# Altium schematic sheet GPS_and_Telemetry.SchDoc
size A4; SheetNumber: 4; SheetTotal: 6
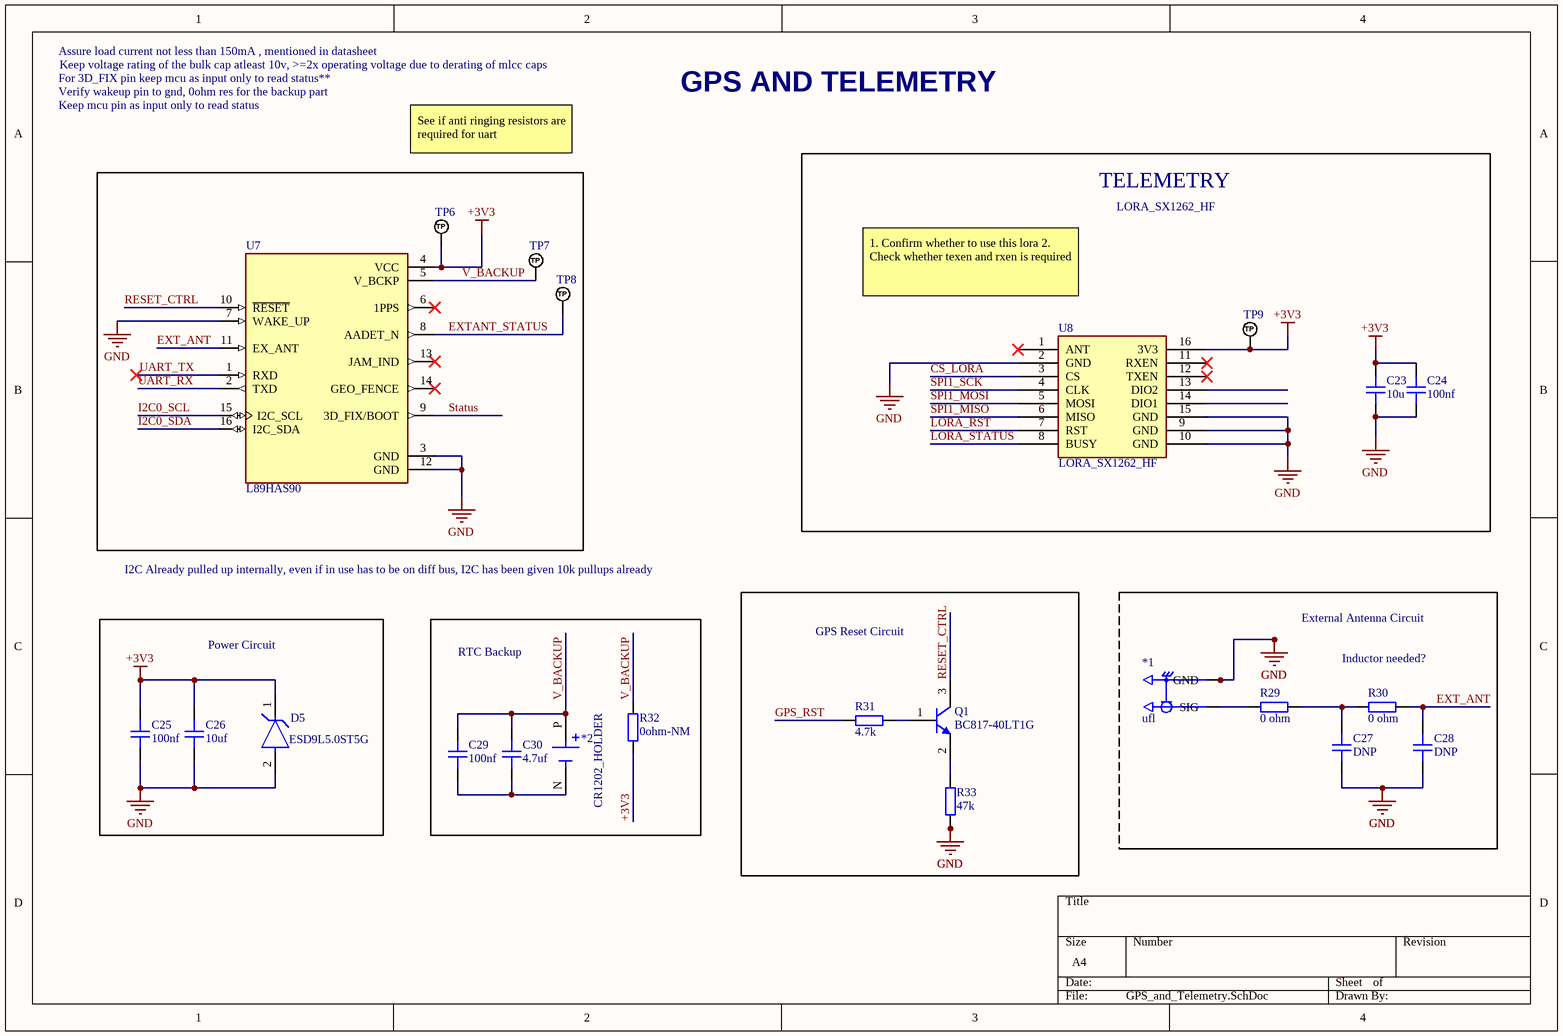
[diagram p0: GPS_and_Telemetry.SchDoc]

## Parts
*1  ufl  [UFL]
*2  CR1202_HOLDER  [CR1220_CELL_HOLDER]
C23  10u  [CAP_0805]
C24  100nf  [CAP_0402]
C25  100nf  [CAP_0402]
C26  10uf  [CAP_0805]
C27  DNP  [CAP_0402]
C28  DNP  [CAP_0402]
C29  100nf  [CAP_0402]
C30  4.7uf  [CAP_0805]
D5  ESD9L5.0ST5G  [On_Semiconductor_514AB_MFG]
Q1  BC817-40LT1G  [ONSC-SOT-23-3-318-08_V]
R29  0 ohm  [RES_0402]
R30  0 ohm  [RES_0402]
R31  4.7k  [RES_0402]
R32  0ohm-NM  [RES_0603]
R33  47k  [RES_0402]
TP6  TEST_POINT_RND_1MM  [PAD_RND_1MM]  (value not drawn)  (no BOM)
TP7  TEST_POINT_RND_1MM  [PAD_RND_1MM]  (value not drawn)  (no BOM)
TP8  TEST_POINT_RND_1MM  [PAD_RND_1MM]  (value not drawn)  (no BOM)
TP9  TEST_POINT_RND_1MM  [PAD_RND_1MM]  (value not drawn)  (no BOM)
U7  L89HAS90  [XCVR_L89HAS90]
U8  LORA_SX1262_HF  [LORA_SX1262_HF]

## Blocks framed on the sheet
TELEMETRY: C23 C24 TP9 U8
Power Circuit: C25 C26 D5
RTC Backup: *2 C29 C30 R32
GPS Reset Circuit: Q1 R31 R33

## Nets
+3V3: C23.2 C24.2 C25.2 C26.2 D5.1(C) R32.1 TP6.1(TP) TP9.1(TP) U7.4(VCC) U8.16(3V3)
GND: *1.1(GND) *1.2(GND) C23.1 C24.1 C25.1 C26.1 C27.1 C28.1 D5.2(A) R33.1 U7.3(GND) U7.7(WAKE_UP) U7.12(GND) U8.2(GND) U8.9(GND) U8.10(GND) U8.15(GND)
CS_LORA: U8.3(CS)
EXT_ANT: C28.2 R30.2 U7.11(EX_ANT)
EXTANT_STATUS: TP8.1(TP) U7.8(AADET_N)
GPS_RST: R31.1
I2C0_SCL: U7.15(I2C_SCL)
I2C0_SDA: U7.16(I2C_SDA)
LORA_RST: U8.7(RST)
LORA_STATUS: U8.8(BUSY)
RESET_CTRL: Q1.3(C) U7.10(~{RESET})
SPI1_MISO: U8.6(MISO)
SPI1_MOSI: U8.5(MOSI)
SPI1_SCK: U8.4(CLK)
Status: U7.9(3D_FIX/BOOT)
UART_RX: U7.2(TXD)
UART_TX: U7.1(RXD)
V_BACKUP: *2.P(POS) C29.2 C30.2 R32.2 TP7.1(TP) U7.5(V_BCKP)
Net*1_3: *1.3(SIG) R29.1
Net*2_N: *2.N(NEG) C29.1 C30.1
NetC27_2: C27.2 R29.2 R30.1
NetQ1_1: Q1.1(B) R31.2
NetQ1_2: Q1.2(E) R33.2

Not connected (* = marked no-connect by the designer): U7 6(1PPS)* 13(JAM_IND)* 14(GEO_FENCE)*; U8 1(ANT)* 11(RXEN)* 12(TXEN)* 13(DIO2) 14(DIO1)

## Notes on the sheet
- Assure load current not less than 150mA , mentioned in datasheet
- For 3D_FIX pin keep mcu as input only to read status**
- Verify wakeup pin to gnd, 0ohm res for the backup part
- Keep mcu pin as input only to read status
- Keep voltage rating of the bulk cap atleast 10v, >=2x operating voltage due to derating of mlcc caps
- GPS AND TELEMETRY
- See if anti ringing resistors are required for uart
- LORA_SX1262_HF
- 1. Confirm whether to use this lora 2. Check whether texen and rxen is required
- I2C Already pulled up internally, even if in use has to be on diff bus, I2C has been given 10k pullups already
- External Antenna Circuit
- (near R30) Inductor needed?

## Library data of the parts
C23 C26 C30 = CAP_0805: Capacitor SMD 0805; Manufacturer: *; Manufacturer Part Number: *; Distributor Link: *; LCSC: *; Rating: *; Dielectric: *
C24 C25 C27-C29 = CAP_0402: Capacitor SMD 0402; Manufacturer: *; Manufacturer Part Number: *; Distributor Link: *; LCSC: *; Rating: *; Dielectric: *
D5 = CMP-1063-00114-2: NexarPartId: 6987432; Manufacturer Lifecycle Status: ACTIVE; Polarity: Unidirectional; Max Surge Current: 1A; Reverse Standoff Voltage: 5V; ESD Protection: Yes; Capacitance: 500fF; Power Line Protection: No; Test Current: 1mA; Max Reverse Leakage Current: 1µA; Peak Pulse Power: 150mW; Clamping Voltage: 9.8V; Number of Unidirectional Channels: 1; Element Configuration: Single; Min Breakdown Voltage: 5.4V; Max Junction Temperature (Tj): 150°C; Reverse Breakdown Voltage: 5.8V; Length: 800µm; Min Operating Temperature: -55°C; Packaging: Tape and Reel; Width: 650µm; Height: 400µm; RoHS: Compliant; Number of Pins: 2; Lifecycle Status: Production; Schedule B: 8536300000; Operating Supply Voltage: 5V; Termination: SMD/SMT; Power Dissipation: 150mW; Direction: Unidirectional; Depth: 600µm; Composition: Zener; Lead Free: Lead Free; Contact Plating: Tin; Number of Lines: 1; Peak Pulse Current: 1A; REACH SVHC: No SVHC; Number of Channels: 1; Radiation Hardening: No; Number of Elements: 1; Max Operating Temperature: 150°C; Max Breakdown Voltage: 5.4V; Case/Package: SOD-923-2; Breakdown Voltage: 5.4V; Halogen Free: Halogen Free; Leakage Current: 1µA; Working Voltage: 5V
Q1 = CMP-1048-00019-1: General Purpose Transistor, NPN Silicon, 3-Pin SOT-23, Pb-Free, Tape and Reel; Manufacturer: On Semiconductor; fT Min (MHz): 100; IC Continuous (A): 0.5; ComponentLink2URL: http://www.onsemi.com/pub_link/Collateral/BC817-16LT1-D.PDF; DatasheetVersion: Rev. 12; ComponentLink3URL: http://www.onsemi.cn/pub_link/Collateral/318-08.PDF; ComponentLink3Description: Package Specification; ComponentLink1Description: Manufacturer URL; Mounting Technology: Surface Mount; ComponentLink1URL: http://www.onsemi.com/; Packing: Tape and Reel; ComponentLink2Description: Datasheet; Polarity: NPN; RoHS: TRUE; PackageVersion: Rev. AP, 11/2009; PartNumber: BC817-40LT1G; PackageDescription: 3-Pin Small Outline Transistor, Body 2.92 x 1.3 mm, Pitch 0.95 mm; PackageReference: SOT-23-3-318-08
R29-R31 R33 = RES_0402: Resistor SMD 0402; Manufacturer: *; Manufacturer Part Number: *; Distributor Link: *; LCSC: *
R32 = RES_0603: Resistor SMD 0603; Manufacturer: *; Manufacturer Part Number: *; Distributor Link: *; LCSC: *
TP6-TP9 = CMP-019-000001-1: Test Point Round 1mm (NO BOM); Design Item ID: TEST_POINT_RND_1MM; Source: Schematic-Lib-PhilsLab.SchLib
U7 = L89HAS90: L89 is a high performance IRNSS-enabled GNSS module, capable of acquiring and tracing GPS, IRNSS, GLONASS, BeiDou, Galileo and QZSS signals.; MF: Quectel; Value: *; Check_prices: https://www.snapeda.com/parts/L89HAS90/Quectel/view-part/?ref=eda; MP: L89HAS90; Purchase-URL: https://pricing.snapeda.com/search/part/L89HAS90/?ref=eda; SnapEDA_Link: https://www.snapeda.com/parts/L89HAS90/Quectel/view-part/?ref=snap; Package: Custom Quectel; Digi-Key_Part_Number: 2958-L89HA-S90TR-ND